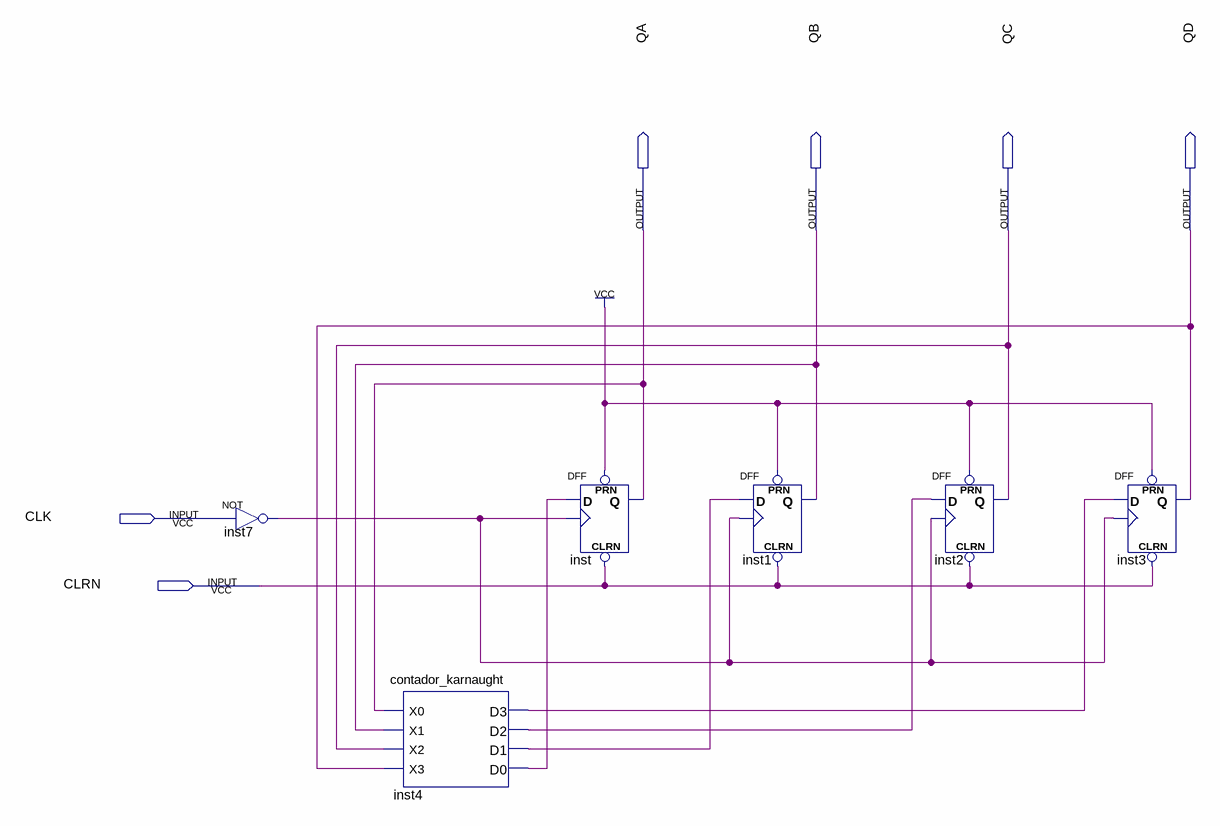
[diagram p0: schematic sheet]
// Quartus schematic contador_hexadecimal_crescente.bdf as structural Verilog: 6 symbols, 6 pins
module contador_hexadecimal_crescente (
  input  CLK,
  input  CLRN,
  output QA,
  output QB,
  output QC,
  output QD
);

  wire inst4_d0, inst4_d1, inst4_d2, inst4_d3, inst7_out;

  not inst7 (inst7_out, CLK);
  contador_karnaught inst4 (
    .X0(QA), .X1(QB), .X2(QC), .X3(QD), .D3(inst4_d3), .D2(inst4_d2), .D1(inst4_d1), .D0(inst4_d0));
  DFF inst (.CLRN(CLRN), .CLK(inst7_out), .D(inst4_d0), .PRN(1'b1), .Q(QA));
  DFF inst1 (.CLRN(CLRN), .CLK(inst7_out), .D(inst4_d1), .PRN(1'b1), .Q(QB));
  DFF inst2 (.CLRN(CLRN), .CLK(inst7_out), .D(inst4_d2), .PRN(1'b1), .Q(QC));
  DFF inst3 (.CLRN(CLRN), .CLK(inst7_out), .D(inst4_d3), .PRN(1'b1), .Q(QD));
endmodule
